# EAGLE design fuse-b-2 (EAGLE 9.6.2)
AUTHOR: Balazs Racz; DRAWING_TITLE: MEB Schalterwerk Projekt; LICENSE: Licensed by the Solderpad Hardware License V2.0; PAGE: Sicherung für Signalstromkreise; REVIEWER: n/a; REVISION: B2; YEAR: 2023
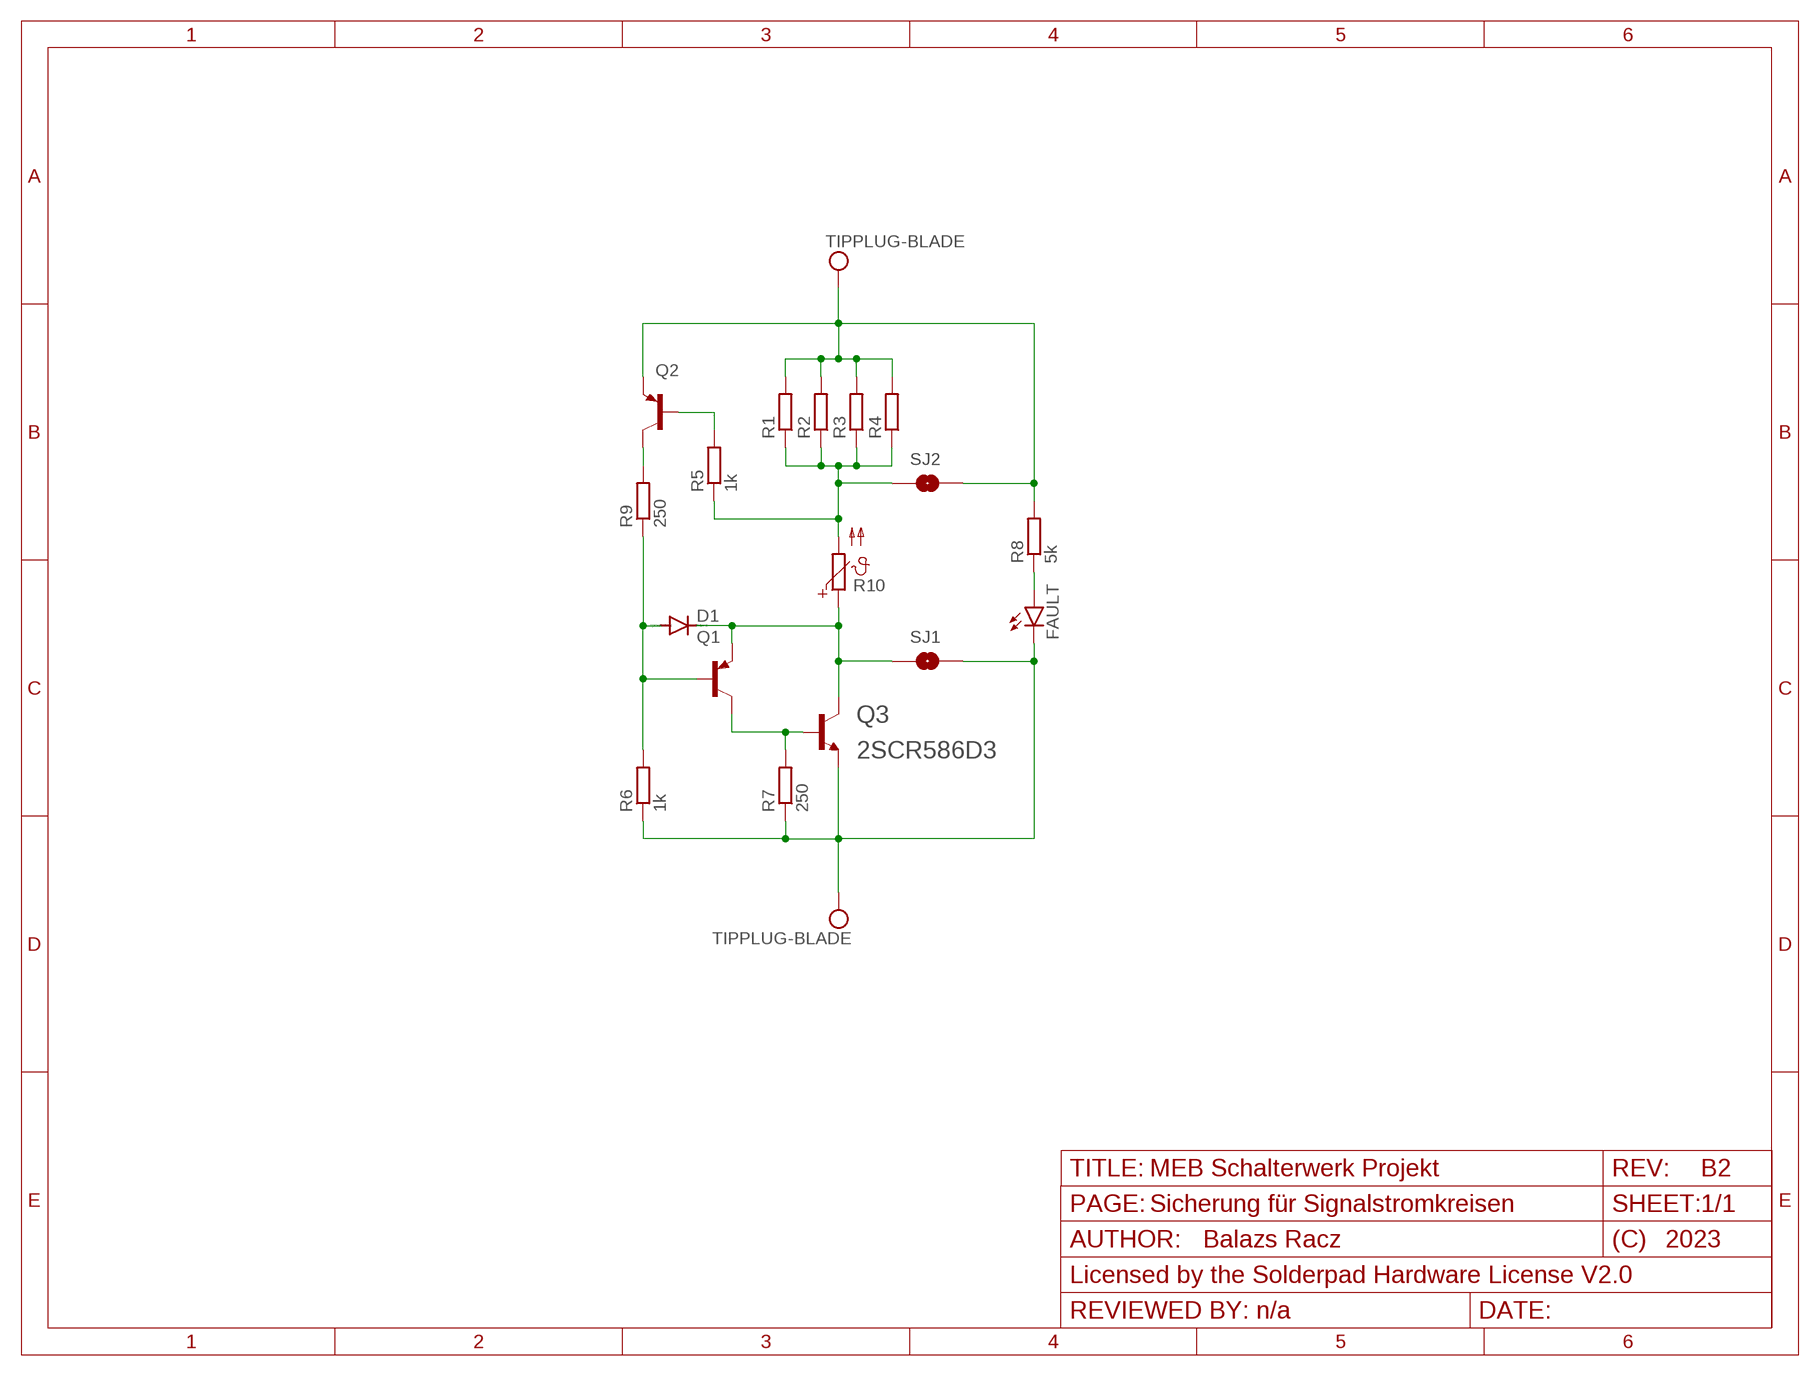
[diagram p0: schematic, sheet 1]
FRAME2 (FRAME_A_L): PAGE: Sicherung für Signalstromkreisen

## Parts
D1  DIODE-MINIMELF  [MINIMELF]
FAULT  LEDCHIPLED_0603  [CHIPLED_0603]
Q1  BCX71SMD  [SOT23]
Q2  BCX71SMD  [SOT23]
Q3  2SCR586D3  2SCR586D3TL1  [D-PAK_TO252AA]
R1  R-EU_R2512  [R2512]
R2  R-EU_R2512  [R2512]
R3  R-EU_R2512  [R2512]
R4  R-EU_R2512  [R2512]
R5  1k  R-EU_R0805  [R0805]
R6  1k  R-EU_R0805  [R0805]
R7  250  R-EU_R0805  [R0805]
R8  5k  R-EU_R0805  [R0805]
R9  250  R-EU_R0805  [R0805]
R10  PTC_1812  [PTC1812]
SJ1  SJRND2  [SJ_RND2]
SJ2  SJRND2  [SJ_RND2]
U$1  TIPPLUG-BLADE  [BLADEPLUG-9.5X1.25]
U$2  TIPPLUG-BLADE  [BLADEPLUG-9.5X1.25]

## Nets
FUSEIN: R1.1 R2.1 R3.1 R4.1 R5.1 R10.2 SJ2.P$1
FUSEOUT: D1.C Q1.2(E) Q3.4(C) R10.1 SJ1.P$1
N$1: Q2.1(B) R5.2
N$4: D1.A Q1.1(B) R6.2 R9.1
N$5: Q1.3(C) Q3.1(B) R7.2
N$6: FAULT.A R8.1
N$8: Q2.3(C) R9.2
VIN: Q2.2(E) R1.2 R2.2 R3.2 R4.2 R8.2 SJ2.P$2 U$1.PB($1) U$1.PT($1)
VOUT: FAULT.C Q3.3(E) R6.1 R7.1 SJ1.P$2 U$2.PB($1) U$2.PT($1)

## Library data of the parts
D1 = diode:DIODE-: DIODE
FAULT = led:LED: LED OSRAM: - CHIPLED LG R971, LG N971, LY N971, LG Q971, LY Q971, LO R971, LY R971 LH N974, LH R974 LS Q976, LO Q976, LY Q976 LO Q996 - Hyper CHIPLED LW Q18S LB Q993, LB Q99A, LB R99A - SideLED LS A670, LO A670, LY A670, LG A670, LP A670 LB A673, LV A673, LT A673, LW A673 LH A674 LY A675 LS A676, LA A676, LO A676, LY A676, LW A676 LS A679, LY A679, LG A679 - Hyper Micro SIDELED® LS Y876, LA Y876, LO Y876, LY Y876 LT Y87S - SmartLED LW L88C, LW L88S LB L89C, LB L89S, LG L890 LS L89K, LO L89K, LY L89K LS L896, LA L896, LO L896, LY L896 - TOPLED LS T670, LO T670, LY T670, LG T670, LP T670 LSG T670, LSP T670, LSY T670, LOP T670, LYG T670 LG T671, LOG T671, LSG T671 LB T673, LV T673, LT T673, LW T673 LH T674 LS T676, LA T676, LO T676, LY T676, LB T676, LH T676, LSB T676, LW T676 LB T67C, LV T67C, LT T67C, LS T67K, LO T67K, LY T67K, LW E67C LS E67B, LA E67B, LO E67B, LY E67B, LB E67C, LV E67C, LT E67C LW T67C LS T679, LY T679, LG T679 LS T770, LO T770, LY T770, LG T770, LP T770 LB T773, LV T773, LT T773, LW T773 LH T774 LS E675, LA E675, LY E675, LS T675 LS T776, LA T776, LO T776, LY T776, LB T776 LHGB T686 LT T68C, LB T68C - Hyper Mini TOPLED® LB M676 - Mini TOPLED Santana® LG M470 LS M47K, LO M47K, LY M47K Source: http://www.osram.convergy.de LUXEON: - LUMILED® LXK2-PW12-R00, LXK2-PW12-S00, LXK2-PW14-U00, LXK2-PW14-V00 LXK2-PM12-R00, LXK2-PM12-S00, LXK2-PM14-U00 LXK2-PE12-Q00, LXK2-PE12-R00, LXK2-PE12-S00, LXK2-PE14-T00, LXK2-PE14-U00 LXK2-PB12-K00, LXK2-PB12-L00, LXK2-PB12-M00, LXK2-PB14-N00, LXK2-PB14-P00, LXK2-PB14-Q00 LXK2-PR12-L00, LXK2-PR12-M00, LXK2-PR14-Q00, LXK2-PR14-R00 LXK2-PD12-Q00, LXK2-PD12-R00, LXK2-PD12-S00 LXK2-PH12-R00, LXK2-PH12-S00 LXK2-PL12-P00, LXK2-PL12-Q00, LXK2-PL12-R00 Source: www.luxeon.com KINGBRIGHT: KA-3528ASYC Source: www.kingbright.com
Q1 Q2 = transistor-pnp:BCX71SMD: PNP Transistor
Q3 = eagleparts:2SCR586D3TL1
R1-R9 = rcl:R-EU_: RESISTOR, European symbol; SPICEPREFIX: R
R10 = tcs:PTC_: PHILIPS PTC
SJ1 SJ2 = eagleparts:SJ: SMD solder JUMPER
U$1 U$2 = eagleparts:TIPPLUG

## Board
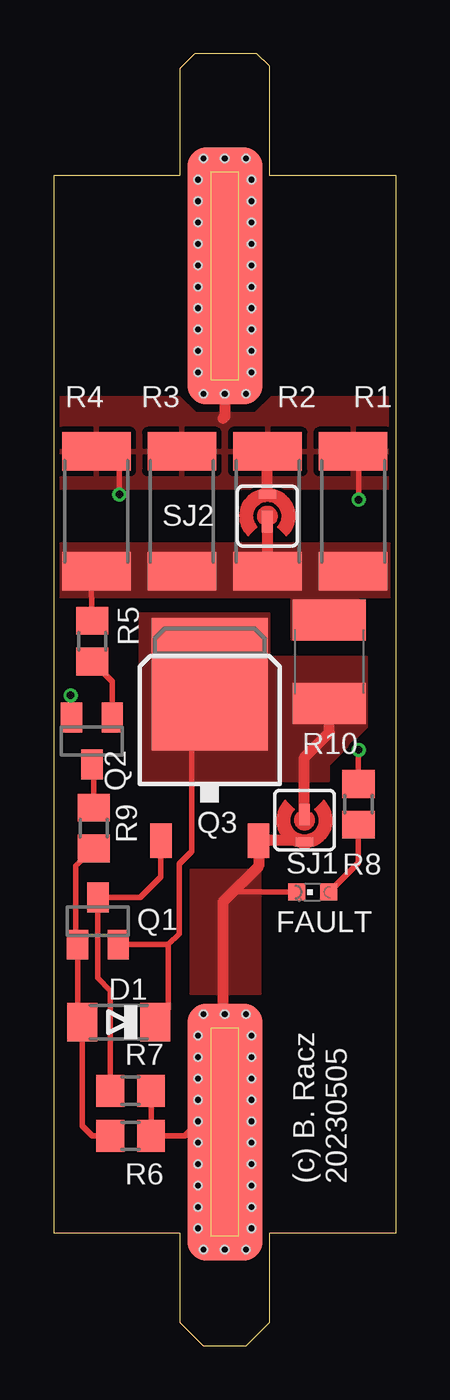
[diagram p1: board, top side]
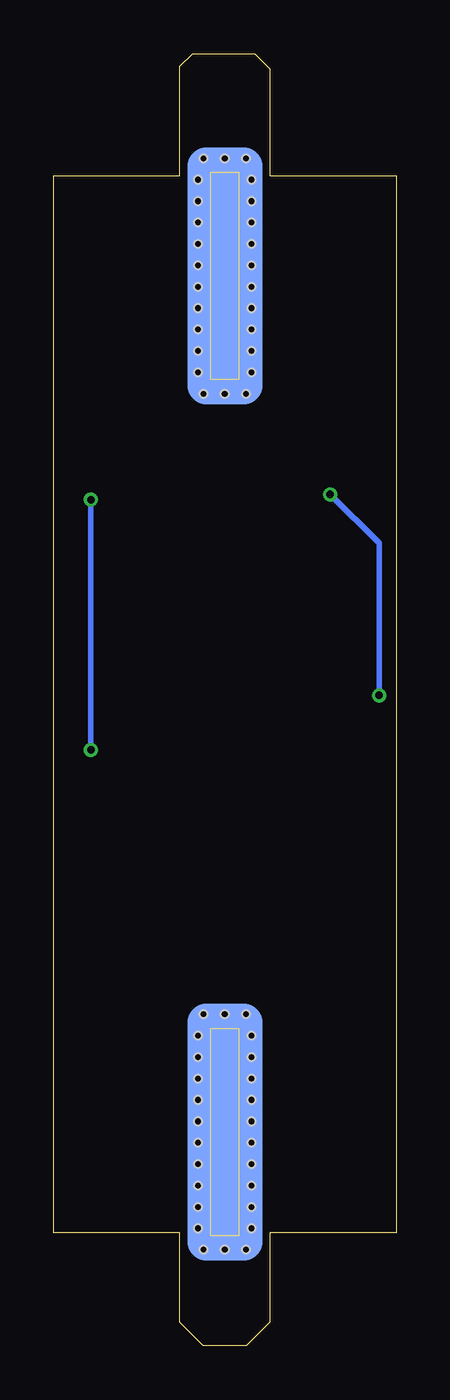
[diagram p2: board, bottom side, seen from below]

Size 16 x 60.4 mm. Coordinates in mm from the lower left corner, seen from the top.
Outline: 5.9,5.3 5.9,1.1 7,0 9,0 10.1,1.1 10.1,5.3 16,5.3 16,54.7 10.1,54.7 10.1,59.8 9.5,60.4 6.6,60.4 5.9,59.7 5.9,54.7 0,54.7 0,5.3 5.9,5.3
Copper layers (1*16): Top 0.035mm / dielectric 1.5mm / Bottom 0.035mm
Design rules "SeeedStudio_2layer_DRU_no_angle_20140221": minimum track width 6mil, minimum drill 12mil, track to track 6mil, track to pad 6mil, pad to pad 6mil, via to via 6mil, smd to smd 0mil, copper to edge 10mil, drill to drill 10mil, minimum pad ring 10mil, minimum via ring 6mil, stop-mask expansion 2mil, vias tented up to drill 100mil, thermal gap 10mil

### Footprints (pad centres in the part's own frame; a part is rotated, then mirrored left to right if it is on the bottom)
MINIMELF = smd 1.4 x 1.8: A 1.7,0; C -1.7,0
CHIPLED_0603 = smd 0.8 x 0.8: A 0,-0.75; C 0,0.75
SOT23 = smd 1 x 1.4: 1 -0.95,-1.1; 2 0.95,-1.1; 3 0,1.1
D-PAK_TO252AA = smd 1 x 1.6: 1 -2.28,-4.8; 3 2.28,-4.8 | smd 5.4 x 6.2: 4 0,2.5
R2512 = smd 1.8 x 3.2: 1 -2.8,0; 2 2.8,0
R0805 = smd 1.3 x 1.5: 1 -0.95,0; 2 0.95,0
PTC1812 = smd 1.9 x 3.4: 1 -1.95,0; 2 1.95,0
SJ_RND2 = smd 1.016 x 0.508: P$1 -0.254,0 | smd 0.406 x 0.813: P$2 1.016,0
BLADEPLUG-9.5X1.25 = smd 12 x 3.5 bottom: PB 0,0 | smd 12 x 3.5: PT 0,0 | hole 0.35: -4.5,1.25; -3.5,1.25; -2.5,1.25; -1.5,1.25; -0.5,1.25; 0.5,1.25; 1.5,1.25; 2.5,1.25; 3.5,1.25; 4.5,1.25; -4.5,-1.25; -3.5,-1.25; -2.5,-1.25; -1.5,-1.25; -0.5,-1.25; 0.5,-1.25; 1.5,-1.25; 2.5,-1.25; 3.5,-1.25; 4.5,-1.25; -5.5,1; -5.5,0; -5.5,-1; 5.5,1; 5.5,0; 5.5,-1

### Placement (x,y rotation side)
D1  3.05,15.13 180 top
FAULT  12.11,21.21 90 top
Q1  2.07,19.86 0 top
Q2  1.79,28.28 180 top
Q3  7.3,28.42 0 top
R1  14,39 90 top
R2  10,39 90 top
R3  6,39 90 top
R4  2,39 90 top
R5  1.81,32.94 270 top
R6  3.61,9.83 180 top
R7  3.61,11.93 180 top
R8  14.25,25.31 90 top
R9  1.88,24.2 90 top
R10  12.88,31.97 90 top
SJ1  11.72,24.57 270 top
SJ2  9.99,38.78 90 top
U$1  8,50 270 bottom
U$2  8,10 90 bottom

### Tracks (layer width: path | path; a pad name or v marks a point on that pad's centre or on a via)
FUSEIN
  Top 0.254: 0.67,36.2 1.81,36.2 | 1.81,36.2 R4.1 | R5.1 1.74,36.13 1.81,36.2
  Top 0.508: 13.96,36.24 R1.1 | SJ2.P$1 R2.1
  pour Top (no thermals): 16.03,34.97 16.03,37.51 0.03,37.51 0.03,34.97 11.11,34.97 11.11,32.99 14.26,32.99 14.26,34.97
FUSEOUT
  Top 0.254: 6.03,29.65 6.45,30.07 | 6.45,30.07 Q3.4 | D1.C 5.37,15.75 5.37,18.76 | Q1.2 5.37,18.76 | 5.37,18.76 5.87,19.26 5.87,22.53 6.45,23.11 6.45,30.07
  Top 0.406: R10.1 12.88,28.98
  Top 0.508: SJ1.P$1 11.72,27.51 12.88,28.67 R10.1
  pour Top (no thermals): 3.99,34.26 10.09,34.26 10.09,32.23 14.66,32.23 14.66,28.93 12.88,27.15 12.88,26.39 3.99,26.39
N$1
  Top 0.254: Q2.1 2.74,31.06 R5.2
N$4
  Top 0.254: R6.2 1.81,9.83 1.35,10.29 D1.A 1.35,15.36 1.14,15.36 1.12,15.35 Q1.1 1.05,18.83 1.05,22.42 R9.1
N$5
  Top 0.254: R7.2 2.66,16.6 2.06,17.19 2.06,20.95 Q1.3 4.05,20.95 5.02,21.92 Q3.1
N$6
  Top 0.254: R8.1 14.25,22.58 12.88,21.21 FAULT.A
N$8
  Top 0.254: Q2.3 1.88,27.09 R9.2
VIN  (via drill 0.35)
  Top 0.152: 14.25,27.85 v14.26,27.86 | 14.26,41.58 14.03,41.8 | 3.08,41.83 2.03,41.83 R4.2
  Top 0.254: 14.03,41.8 R1.2 | R8.2 14.25,27.85 | v14.26,39.54 14.26,41.58 | v3.08,39.8 3.08,41.83 | Q2.2 0.84,30.35 v0.79,30.4
  Top 0.508: SJ2.P$2 R2.2 | U$1.PT 8,43.45 7.91,43.35
  Bottom 0.254: v14.26,27.86 v14.26,39.54 | v0.79,30.4 0.79,37.51 v3.08,39.8
  pour Top: 0.29,40.05 15.63,40.05 15.63,44.37 10.19,44.37 9.43,43.61 6.64,43.61 5.87,44.37 0.29,44.37
VOUT
  Top 0.254: R7.1 R6.1 6.13,9.83 7.91,11.6 7.91,10.09 U$2.PT | SJ1.P$2 11.66,23.62 | FAULT.C 8.37,21.21 8.03,20.88
  Top 0.508: 11.66,23.62 Q3.3 9.58,22.42 8.03,20.88 7.91,20.75 7.91,11.6
  pour Top: 6.38,16.43 9.68,16.43 9.68,22.27 6.38,22.27

### Text on the board
tNames: (c) B. Racz / 20230505